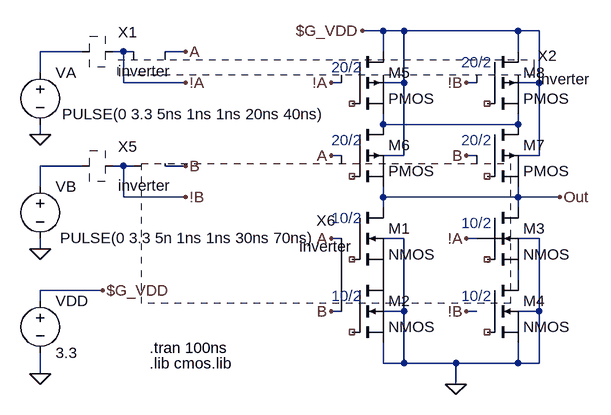
[diagram p0: schematic gate1.asc]
gate1.asc, the LTspice schematic file:
Version 4
SHEET 1 880 868
WIRE -160 -208 -192 -208
WIRE -128 -208 -160 -208
WIRE 48 -208 -128 -208
WIRE 80 -208 48 -208
WIRE -624 -176 -688 -176
WIRE -560 -176 -576 -176
WIRE -544 -176 -560 -176
WIRE -464 -176 -496 -176
WIRE -160 -176 -160 -208
WIRE 48 -176 48 -208
WIRE -688 -144 -688 -176
WIRE -560 -128 -560 -176
WIRE -464 -128 -560 -128
WIRE -224 -128 -240 -128
WIRE -128 -128 -128 -208
WIRE -128 -128 -160 -128
WIRE -16 -128 -32 -128
WIRE 80 -128 80 -208
WIRE 80 -128 48 -128
WIRE -160 -64 -160 -80
WIRE 48 -64 48 -80
WIRE 48 -64 -160 -64
WIRE -688 -48 -688 -64
WIRE -224 -16 -240 -16
WIRE -128 -16 -128 -128
WIRE -128 -16 -160 -16
WIRE -16 -16 -32 -16
WIRE 80 -16 80 -128
WIRE 80 -16 48 -16
WIRE -624 0 -688 0
WIRE -560 0 -576 0
WIRE -544 0 -560 0
WIRE -464 0 -496 0
WIRE -688 32 -688 0
WIRE -560 48 -560 0
WIRE -464 48 -560 48
WIRE -160 48 -160 32
WIRE 48 48 48 32
WIRE 48 48 -160 48
WIRE 112 48 48 48
WIRE -160 64 -160 48
WIRE 48 64 48 48
WIRE -224 112 -240 112
WIRE -128 112 -160 112
WIRE -16 112 -32 112
WIRE 80 112 48 112
WIRE -688 128 -688 112
WIRE -160 176 -160 160
WIRE 48 176 48 160
WIRE -592 192 -688 192
WIRE -688 208 -688 192
WIRE -224 224 -240 224
WIRE -128 224 -128 112
WIRE -128 224 -160 224
WIRE -16 224 -32 224
WIRE 80 224 80 112
WIRE 80 224 48 224
WIRE -160 304 -160 272
WIRE -128 304 -128 224
WIRE -128 304 -160 304
WIRE -48 304 -128 304
WIRE 48 304 48 272
WIRE 48 304 -48 304
WIRE 80 304 80 224
WIRE 80 304 48 304
WIRE -688 320 -688 288
WIRE -48 336 -48 304
FLAG 112 48 Out
FLAG -48 336 0
FLAG -192 -208 $G_VDD
FLAG -688 320 0
FLAG -592 192 $G_VDD
FLAG -240 112 A
FLAG -240 -16 A
FLAG -240 224 B
FLAG -32 -16 B
FLAG -240 -128 !A
FLAG -32 112 !A
FLAG -32 -128 !B
FLAG -32 224 !B
FLAG -688 -48 0
FLAG -464 -176 A
FLAG -464 -128 !A
FLAG -688 128 0
FLAG -464 0 B
FLAG -464 48 !B
SYMBOL voltage -688 -160 R0
WINDOW 3 34 80 Left 2
WINDOW 123 0 0 Left 2
WINDOW 39 0 0 Left 2
SYMATTR Value PULSE(0 3.3 5ns 1ns 1ns 20ns 40ns)
SYMATTR InstName VA
SYMBOL voltage -688 192 R0
WINDOW 123 0 0 Left 2
WINDOW 39 0 0 Left 2
SYMATTR InstName VDD
SYMATTR Value 3.3
SYMBOL inverter -608 -176 R0
SYMATTR InstName X1
SYMBOL inverter -528 -176 R0
SYMATTR InstName X2
SYMBOL voltage -688 16 R0
WINDOW 3 31 95 Left 2
WINDOW 123 0 0 Left 2
WINDOW 39 0 0 Left 2
SYMATTR Value PULSE(0 3.3 5n 1ns 1ns 30ns 70ns)
SYMATTR InstName VB
SYMBOL inverter -608 0 R0
SYMATTR InstName X5
SYMBOL inverter -528 0 R0
SYMATTR InstName X6
SYMBOL nmos -208 64 R0
SYMATTR InstName M1
SYMATTR Value2 l=0.6u w=3u
SYMATTR SpiceModel ""
SYMATTR Value NMOS
SYMBOL nmos -208 176 R0
SYMATTR InstName M2
SYMATTR Value2 l=0.6u w=3u
SYMATTR SpiceModel ""
SYMATTR Value NMOS
SYMBOL nmos 0 64 R0
SYMATTR InstName M3
SYMATTR Value2 l=0.6u w=3u
SYMATTR SpiceModel ""
SYMATTR Value NMOS
SYMBOL nmos 0 176 R0
SYMATTR InstName M4
SYMATTR Value2 l=0.6u w=3u
SYMATTR SpiceModel ""
SYMATTR Value NMOS
SYMBOL pmos -208 -176 R0
SYMATTR InstName M5
SYMATTR Value2 l=0.6u w=6u
SYMATTR SpiceModel ""
SYMATTR Value PMOS
SYMBOL pmos -208 -64 R0
SYMATTR InstName M6
SYMATTR Value2 l=0.6u w=6u
SYMATTR SpiceModel ""
SYMATTR Value PMOS
SYMBOL pmos 0 -64 R0
SYMATTR InstName M7
SYMATTR Value2 l=0.6u w=6u
SYMATTR SpiceModel ""
SYMATTR Value PMOS
SYMBOL pmos 0 -176 R0
SYMATTR InstName M8
SYMATTR Value2 l=0.6u w=6u
SYMATTR SpiceModel ""
SYMATTR Value PMOS
TEXT -520 280 Left 2 !.tran 100ns
TEXT -520 304 Left 2 !.lib cmos.lib
TEXT -240 80 Left 2 ;10/2
TEXT -240 200 Left 2 ;10/2
TEXT -40 200 Left 2 ;10/2
TEXT -40 88 Left 2 ;10/2
TEXT -240 -152 Left 2 ;20/2
TEXT -240 -40 Left 2 ;20/2
TEXT -40 -160 Left 2 ;20/2
TEXT -40 -40 Left 2 ;20/2

The netlist it stands for:
* gate1.asc
VA N001 0 PULSE(0 3.3 5ns 1ns 1ns 20ns 40ns)
VDD $G_VDD 0 3.3
* X1: inverter (symbol inverter not available, pin order unknown); nets seen at it: !A, N001
* X2: inverter (symbol inverter not available, pin order unknown); nets seen at it: !A, !B, $G_VDD, A
VB N003 0 PULSE(0 3.3 5n 1ns 1ns 30ns 70ns)
* X5: inverter (symbol inverter not available, pin order unknown); nets seen at it: !B, N003
* X6: inverter (symbol inverter not available, pin order unknown); nets seen at it: !A, !B, $G_VDD, 0, A, B
M1 Out NC_01 N004 N004 NMOS l=0.6u w=3u
M2 N004 NC_02 0 0 NMOS l=0.6u w=3u
* M3: NMOS l=0.6u w=3u (symbol nmos not certain, pin order unknown); nets seen at it: N005, Out
* M4: NMOS l=0.6u w=3u (symbol nmos not certain, pin order unknown); nets seen at it: 0, N005
M5 $G_VDD NC_05 N002 N002 PMOS l=0.6u w=6u
M6 N002 NC_06 Out Out PMOS l=0.6u w=6u
M7 N002 NC_07 Out Out PMOS l=0.6u w=6u
M8 $G_VDD NC_08 N002 N002 PMOS l=0.6u w=6u
.model NMOS NMOS
.model PMOS PMOS
.lib standard.mos
.tran 100ns
.lib cmos.lib
* 10/2
* 10/2
* 10/2
* 10/2
* 20/2
* 20/2
* 20/2
* 20/2
.backanno
.end